# Altium schematic sheet Radio.SchDoc
size A4; SheetNumber: 10; SheetTotal: 10
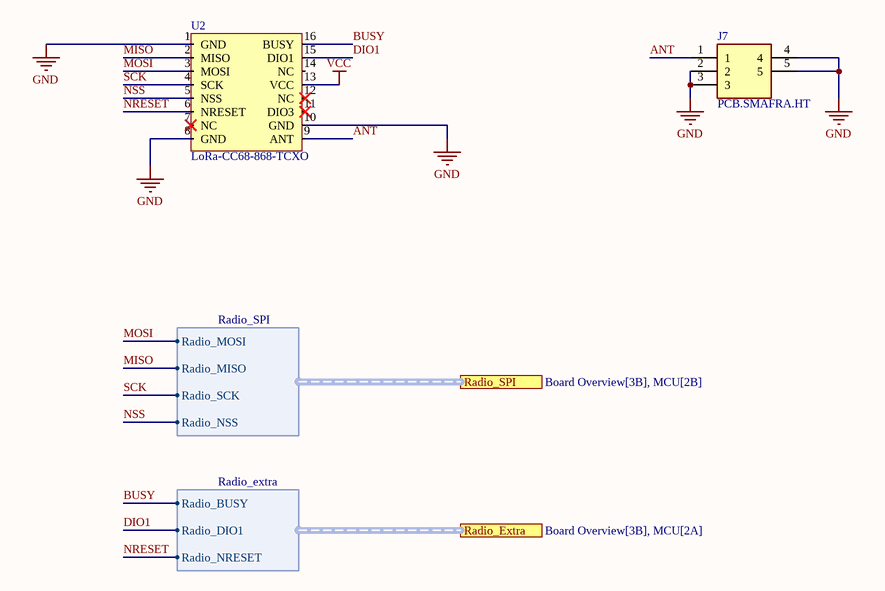
[diagram p0: Radio.SchDoc]

## Parts
J7  PCB.SMAFRA.HT  [PCBSMAFRAHT]
U2  LoRa-CC68-868-TCXO  [LoRa-CC68-868-TCXO-Footprint-1]

## Ports
Radio_Extra (harness Radio_extra, see Board Overview[3B], MCU[2A]), Radio_SPI (harness Radio_SPI, see Board Overview[3B], MCU[2B])

## Harnesses
Radio_SPI: Radio_MOSI, Radio_MISO, Radio_SCK, Radio_NSS
Radio_extra: Radio_BUSY, Radio_DIO1, Radio_NRESET

## Nets
GND: J7.2 J7.3 J7.4 J7.5 U2.1(GND) U2.8(GND) U2.10(GND)
VCC: U2.13(VCC)
ANT: J7.1 U2.9(ANT)
BUSY: U2.16(BUSY) ; port Radio_Extra.Radio_BUSY
DIO1: U2.15(DIO1) ; port Radio_Extra.Radio_DIO1
MISO: U2.2(MISO) ; port Radio_SPI.Radio_MISO
MOSI: U2.3(MOSI) ; port Radio_SPI.Radio_MOSI
NRESET: U2.6(NRESET) ; port Radio_Extra.Radio_NRESET
NSS: U2.5(NSS) ; port Radio_SPI.Radio_NSS
SCK: U2.4(SCK) ; port Radio_SPI.Radio_SCK

Not connected (* = marked no-connect by the designer): U2 7(NC)* 11(DIO3)* 12(NC)* 14(NC)

## Library data of the parts
J7 = CMP-070-000000-1: RF Connectors / Coaxial Connectors SMA RA PCB Mount, Jack, Gold, 50 , Through Hole Pin; Manufacturer_Name: Taoglas; Geometry.Height: 9mm; Manufacturer_Part_Number: PCB.SMAFRA.HT; Mouser Part Number: 960-PCB.SMAFRA.HT; Design Item ID: PCB.SMAFRA.HT; Datasheet Link: *; Mouser Price/Stock: https://www.mouser.co.uk/ProductDetail/Taoglas/PCB.SMAFRA.HT?qs=RuW%2Fu%252BNMQmubIFYcN8w5Dw%3D%3D; Source: PCB.SMAFRA.HT.SchLib
U2 = CMP-00025-00003-3: LoRa-CC68 targeting 868MHz and with a TXCO